# Altium schematic sheet debug.schdoc: DBG
size A4; Date: 10.25.2025; CheckedBy: BCY; DrawnBy: miaow; DocumentNumber: 7; Revision: v1.1.0; SheetNumber: 7; SheetTotal: 14; BoardType: MAIN_PCB; Desc: Debug board interface
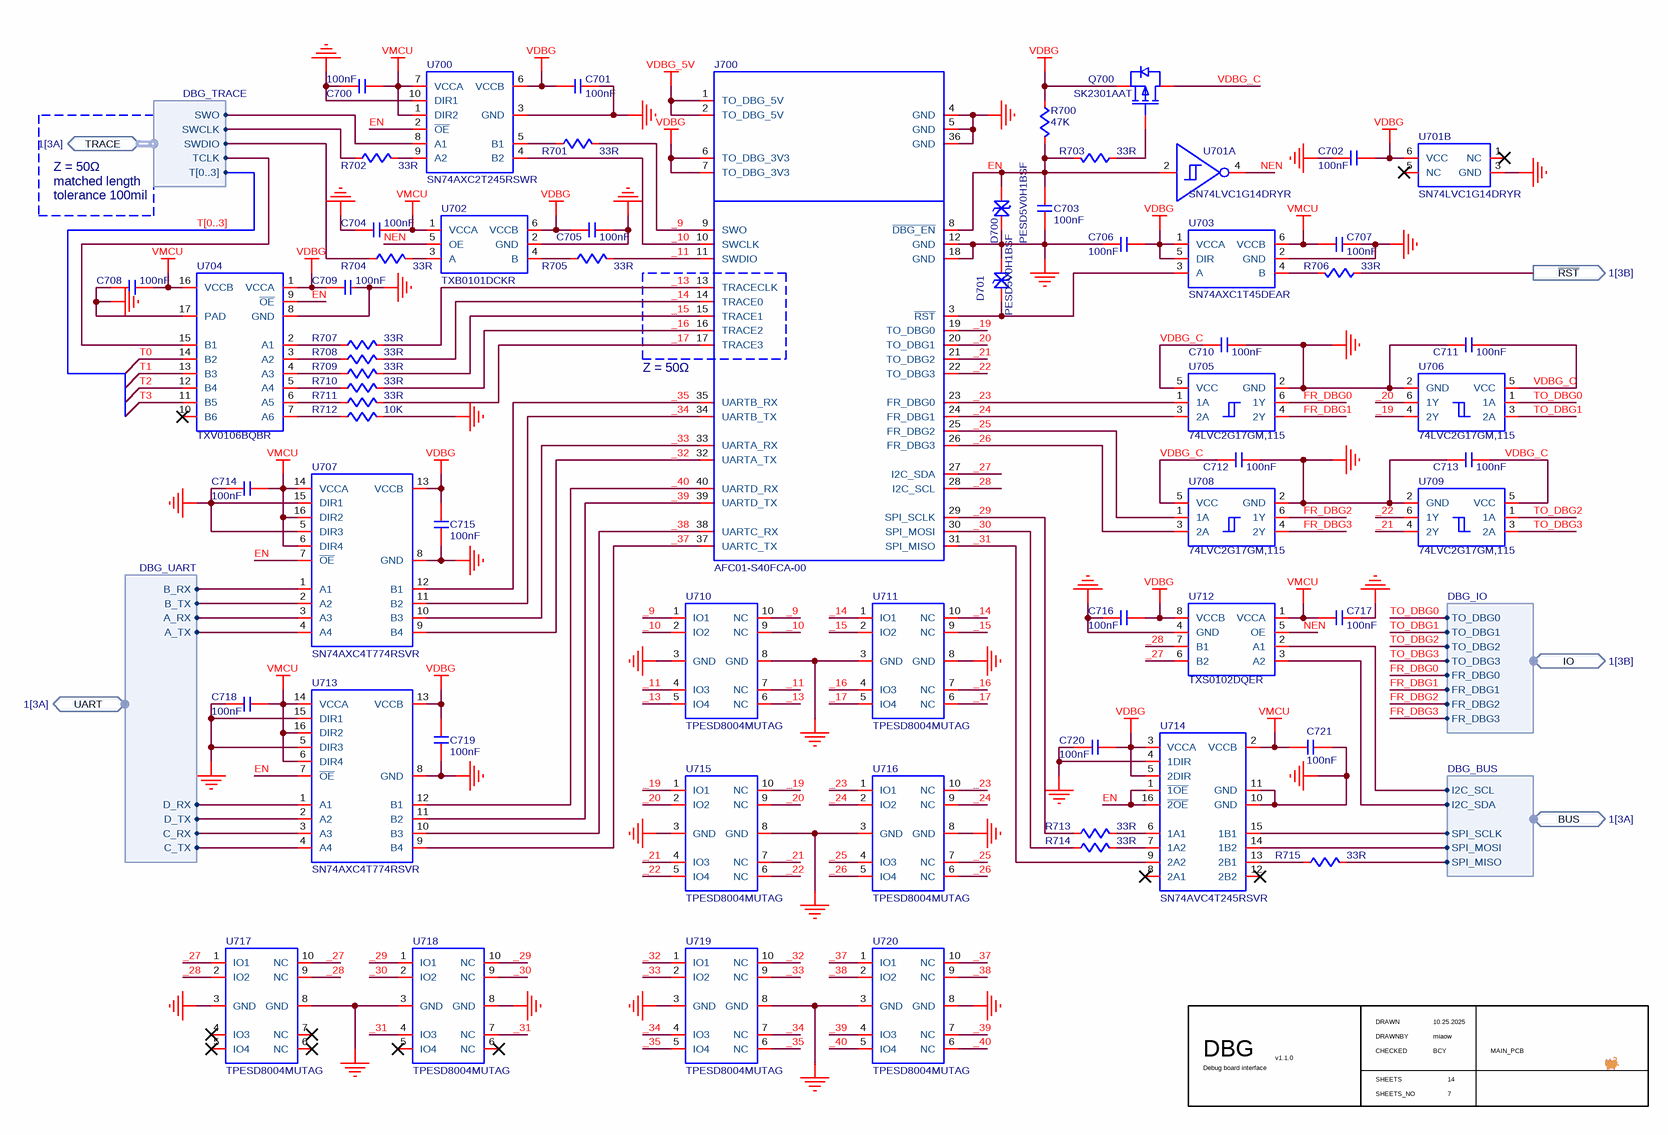
[diagram p0: debug.schdoc]

## Parts
C700  value 100nF  [C0402]  (hidden comment: C-NOMO)
C701  value 100nF  [C0402]  (hidden comment: C-NOMO)
C702  value 100nF  [C0402]  (hidden comment: C-NOMO)
C703  value 100nF  [C0402]  (hidden comment: C-NOMO)
C704  value 100nF  [C0402]  (hidden comment: C-NOMO)
C705  value 100nF  [C0402]  (hidden comment: C-NOMO)
C706  value 100nF  [C0402]  (hidden comment: C-NOMO)
C707  value 100nF  [C0402]  (hidden comment: C-NOMO)
C708  value 100nF  [C0402]  (hidden comment: C-NOMO)
C709  value 100nF  [C0402]  (hidden comment: C-NOMO)
C710  value 100nF  [C0402]  (hidden comment: C-NOMO)
C711  value 100nF  [C0402]  (hidden comment: C-NOMO)
C712  value 100nF  [C0402]  (hidden comment: C-NOMO)
C713  value 100nF  [C0402]  (hidden comment: C-NOMO)
C714  value 100nF  [C0402]  (hidden comment: C-NOMO)
C715  value 100nF  [C0402]  (hidden comment: C-NOMO)
C716  value 100nF  [C0402]  (hidden comment: C-NOMO)
C717  value 100nF  [C0402]  (hidden comment: C-NOMO)
C718  value 100nF  [C0402]  (hidden comment: C-NOMO)
C719  value 100nF  [C0402]  (hidden comment: C-NOMO)
C720  value 100nF  [C0402]  (hidden comment: C-NOMO)
C721  value 100nF  [C0402]  (hidden comment: C-NOMO)
D700  PESD5V0H1BSF  [PESD5V0H1BSF]
D701  PESD5V0H1BSF  [PESD5V0H1BSF]
J700  AFC01-S40FCA-00  [AFC01-S40FCA-00]
Q700  SK2301AAT  [SK2301AAT]
R700  value 47K  [R0402]  (hidden comment: R)
R701  value 33R  [R0402]  (hidden comment: R)
R702  value 33R  [R0402]  (hidden comment: R)
R703  value 33R  [R0402]  (hidden comment: R)
R704  value 33R  [R0402]  (hidden comment: R)
R705  value 33R  [R0402]  (hidden comment: R)
R706  value 33R  [R0402]  (hidden comment: R)
R707  value 33R  [R0402]  (hidden comment: R)
R708  value 33R  [R0402]  (hidden comment: R)
R709  value 33R  [R0402]  (hidden comment: R)
R710  value 33R  [R0402]  (hidden comment: R)
R711  value 33R  [R0402]  (hidden comment: R)
R712  value 10K  [R0402]  (hidden comment: R)
R713  value 33R  [R0402]  (hidden comment: R)
R714  value 33R  [R0402]  (hidden comment: R)
R715  value 33R  [R0402]  (hidden comment: R)
U700  SN74AXC2T245RSWR  [SN74AXC2T245RSWR]
U701  SN74LVC1G14DRYR  [SN74LVC1G14DRYR]  (parts A,B of 2)
U702  TXB0101DCKR  [TXB0101DCKR]
U703  SN74AXC1T45DEAR  [SN74AXC1T45DEAR]
U704  TXV0106BQBR  [TXV0106BQBR]
U705  74LVC2G17GM,115  [74LVC2G17GM,115]
U706  74LVC2G17GM,115  [74LVC2G17GM,115]
U707  SN74AXC4T774RSVR  [SN74AXC4T774RSVR]
U708  74LVC2G17GM,115  [74LVC2G17GM,115]
U709  74LVC2G17GM,115  [74LVC2G17GM,115]
U710  TPESD8004MUTAG  [TPESD8004MUTAG]
U711  TPESD8004MUTAG  [TPESD8004MUTAG]
U712  TXS0102DQER  [TXS0102DQER]
U713  SN74AXC4T774RSVR  [SN74AXC4T774RSVR]
U714  SN74AVC4T245RSVR  [SN74AVC4T245RSVR]
U715  TPESD8004MUTAG  [TPESD8004MUTAG]
U716  TPESD8004MUTAG  [TPESD8004MUTAG]
U717  TPESD8004MUTAG  [TPESD8004MUTAG]
U718  TPESD8004MUTAG  [TPESD8004MUTAG]
U719  TPESD8004MUTAG  [TPESD8004MUTAG]
U720  TPESD8004MUTAG  [TPESD8004MUTAG]

## Ports
BUS (bidir, harness DBG_BUS, see 1[3A]), IO (bidir, harness DBG_IO, see 1[3B]), TRACE (bidir, harness DBG_TRACE, see 1[3A]), UART (bidir, harness DBG_UART, see 1[3A]), ~{RST} (out, see 1[3B])

## Harnesses
DBG_UART: A_TX, A_RX, B_TX, B_RX, C_TX, C_RX, D_TX, D_RX
DBG_TRACE: SWO, SWCLK, SWDIO, TCLK, T[0..3]
DBG_BUS: I2C_SCL, I2C_SDA, SPI_MISO, SPI_MOSI, SPI_SCLK
DBG_IO: TO_DBG0, TO_DBG1, FR_DBG0, TO_DBG3, TO_DBG2, FR_DBG1, FR_DBG2, FR_DBG3

## Nets
GND: C700.2 C701.1 C702.1 C703.2 C704.1 C705.2 C706.1 C707.2 C708.2 C709.2 C710.1 C711.2 C712.1 C713.1 C714.2 C715.1 C716.1 C717.2 C718.2 C719.1 C720.1 C721.2 D700.1 D701.2 J700.4(GND) J700.5(GND) J700.12(GND) J700.18(GND) J700.36(GND) R712.2 U700.3(GND) U700.10(DIR1) U701.3(GND) U702.2(GND) U703.2(GND) U704.8(GND) U704.17(PAD) U705.2(GND) U706.2(GND) U707.5(DIR3) U707.8(GND) U707.15(DIR1) U708.2(GND) U709.2(GND) U710.3(GND) U710.8(GND) U711.3(GND) U711.8(GND) U712.4(GND) U713.5(DIR3) U713.8(GND) U713.15(DIR1) U714.4(1DIR) U714.10(GND) U714.11(GND) U715.3(GND) U715.8(GND) U716.3(GND) U716.8(GND) U717.3(GND) U717.8(GND) U718.3(GND) U718.8(GND) U719.3(GND) U719.8(GND) U720.3(GND) U720.8(GND)
VDBG: C701.2 C702.2 C705.1 C706.2 C709.1 C715.2 C716.2 C719.2 C720.2 J700.6(TO_DBG_3V3) J700.7(TO_DBG_3V3) Q700.S R700.1 U700.6(VCCB) U701.6(VCC) U702.6(VCCB) U703.1(VCCA) U703.5(DIR) U704.1(VCCA) U707.13(VCCB) U712.8(VCCB) U713.13(VCCB) U714.3(VCCA) U714.5(2DIR)
VDBG_5V: J700.1(TO_DBG_5V) J700.2(TO_DBG_5V)
VMCU: C700.1 C704.2 C707.1 C708.1 C714.1 C717.1 C718.1 C721.1 U700.1(DIR2) U700.7(VCCA) U702.1(VCCA) U703.6(VCCB) U704.16(VCCB) U707.6(DIR4) U707.14(VCCA) U707.16(DIR2) U712.1(VCCA) U713.6(DIR4) U713.14(VCCA) U713.16(DIR2) U714.2(VCCB)
_9: J700.9(SWO) R701.2 U710.1(IO1) U710.10(NC)
_10: J700.10(SWCLK) U700.4(B2) U710.2(IO2) U710.9(NC)
_11: J700.11(SWDIO) R705.2 U710.4(IO3) U710.7(NC)
_13: J700.13(TRACECLK) R707.2 U710.5(IO4) U710.6(NC)
_14: J700.14(TRACE0) R708.2 U711.1(IO1) U711.10(NC)
_15: J700.15(TRACE1) R709.2 U711.2(IO2) U711.9(NC)
_16: J700.16(TRACE2) R710.2 U711.4(IO3) U711.7(NC)
_17: J700.17(TRACE3) R711.2 U711.5(IO4) U711.6(NC)
_19: J700.19(TO_DBG0) U706.4(2Y) U715.1(IO1) U715.10(NC)
_20: J700.20(TO_DBG1) U706.6(1Y) U715.2(IO2) U715.9(NC)
_21: J700.21(TO_DBG2) U709.4(2Y) U715.4(IO3) U715.7(NC)
_22: J700.22(TO_DBG3) U709.6(1Y) U715.5(IO4) U715.6(NC)
_23: J700.23(FR_DBG0) U705.1(1A) U716.1(IO1) U716.10(NC)
_24: J700.24(FR_DBG1) U705.3(2A) U716.2(IO2) U716.9(NC)
_25: J700.25(FR_DBG2) U708.1(1A) U716.4(IO3) U716.7(NC)
_26: J700.26(FR_DBG3) U708.3(2A) U716.5(IO4) U716.6(NC)
_27: J700.27(I2C_SDA) U712.6(B2) U717.1(IO1) U717.10(NC)
_28: J700.28(I2C_SCL) U712.7(B1) U717.2(IO2) U717.9(NC)
_29: J700.29(SPI_SCLK) R713.1 U718.1(IO1) U718.10(NC)
_30: J700.30(SPI_MOSI) R714.1 U718.2(IO2) U718.9(NC)
_31: J700.31(SPI_MISO) U714.9(2A2) U718.4(IO3) U718.7(NC)
_32: J700.32(UARTA_TX) U707.9(B4) U719.1(IO1) U719.10(NC)
_33: J700.33(UARTA_RX) U707.10(B3) U719.2(IO2) U719.9(NC)
_34: J700.34(UARTB_TX) U707.11(B2) U719.4(IO3) U719.7(NC)
_35: J700.35(UARTB_RX) U707.12(B1) U719.5(IO4) U719.6(NC)
_37: J700.37(UARTC_TX) U713.9(B4) U720.1(IO1) U720.10(NC)
_38: J700.38(UARTC_RX) U713.10(B3) U720.2(IO2) U720.9(NC)
_39: J700.39(UARTD_TX) U713.11(B2) U720.4(IO3) U720.7(NC)
_40: J700.40(UARTD_RX) U713.12(B1) U720.5(IO4) U720.6(NC)
EN: C703.1 D700.2 J700.8(~{DBG_EN}) R700.2 R703.2 U700.2(~{OE}) U701.2(A) U704.9(~{OE}) U707.7(~{OE}) U713.7(~{OE}) U714.1(~{1OE}) U714.16(~{2OE})
FR_DBG0: U705.6(1Y) ; port IO.FR_DBG0
FR_DBG1: U705.4(2Y) ; port IO.FR_DBG1
FR_DBG2: U708.6(1Y) ; port IO.FR_DBG2
FR_DBG3: U708.4(2Y) ; port IO.FR_DBG3
NEN: U701.4(Y) U702.5(OE) U712.5(OE)
~{RST}: R706.1 ; port ~{RST}
T0: U704.14(B2)
T1: U704.13(B3)
T2: U704.12(B4)
T3: U704.11(B5)
TO_DBG0: U706.1(1A) ; port IO.TO_DBG0
TO_DBG1: U706.3(2A) ; port IO.TO_DBG1
TO_DBG2: U709.1(1A) ; port IO.TO_DBG2
TO_DBG3: U709.3(2A) ; port IO.TO_DBG3
VDBG_C: C710.2 C711.1 C712.2 C713.2 Q700.D U705.5(VCC) U706.5(VCC) U708.5(VCC) U709.5(VCC)
NetD701_1: D701.1 J700.3(~{RST}) U703.3(A)
NetQ700_G: Q700.G R703.1
NetR701_1: R701.1 U700.5(B1)
NetR702_1: R702.1 ; port TRACE.SWCLK
NetR702_2: R702.2 U700.9(A2)
NetR704_1: R704.1 ; port TRACE.SWDIO
NetR704_2: R704.2 U702.3(A)
NetR705_1: R705.1 U702.4(B)
NetR706_2: R706.2 U703.4(B)
NetR707_1: R707.1 U704.2(A1)
NetR708_1: R708.1 U704.3(A2)
NetR709_1: R709.1 U704.4(A3)
NetR710_1: R710.1 U704.5(A4)
NetR711_1: R711.1 U704.6(A5)
NetR712_1: R712.1 U704.7(A6)
NetR713_2: R713.2 U714.6(1A1)
NetR714_2: R714.2 U714.7(1A2)
NetR715_1: R715.1 U714.13(2B1)
NetR715_2: R715.2 ; port BUS.SPI_MISO
NetU700_8: U700.8(A1) ; port TRACE.SWO
NetU704_15: U704.15(B1) ; port TRACE.TCLK
NetU707_1: U707.1(A1) ; port UART.B_RX
NetU707_2: U707.2(A2) ; port UART.B_TX
NetU707_3: U707.3(A3) ; port UART.A_RX
NetU707_4: U707.4(A4) ; port UART.A_TX
NetU712_2: U712.2(A1) ; port BUS.I2C_SCL
NetU712_3: U712.3(A2) ; port BUS.I2C_SDA
NetU713_1: U713.1(A1) ; port UART.D_RX
NetU713_2: U713.2(A2) ; port UART.D_TX
NetU713_3: U713.3(A3) ; port UART.C_RX
NetU713_4: U713.4(A4) ; port UART.C_TX
NetU714_14: U714.14(1B2) ; port BUS.SPI_MOSI
NetU714_15: U714.15(1B1) ; port BUS.SPI_SCLK

Not connected (* = marked no-connect by the designer): U701 1(NC)* 5(NC)*; U704 10(B6)*; U714 8(2A1)* 12(2B2)*; U717 4(IO3)* 5(IO4)* 6(NC)* 7(NC)*; U718 5(IO4)* 6(NC)*

## Buses and harness runs
bus T[0..3]

## Notes on the sheet
- Z = 50Ω
  matched length tolerance 100mil
- (near J700) Z = 50Ω
- DRAWN
- CHECKED
- DRAWNBY
- SHEETS
- SHEETS_NO

## Library data of the parts
C700-C721 = C-NOMO: voltage: 25V; precision: 5%
D700 D701 = PESD5V0H1BSF: TVS/ESD; Supplier 1: LCSC; Supplier Part Number 1: C477989
J700 = FPC-DEBUG: FPC; Supplier 1: LCSC; Supplier Part Number 1: C262674
Q700 = SK2301AAT: PMOS; Supplier 1: LCSC; Supplier Part Number 1: C5334586
R700-R715 = R: precision: 1%
U700 = SN74AXC2T245RSWR: LEVEL SHIFT; Supplier 1: LCSC; Supplier Part Number 1: C1882550
U701 = SN74LVC1G14DRYR: INVERTER - 1bit schmitt; Supplier 1: LCSC; Supplier Part Number 1: C2878125
U702 = TXB0101DCKR: LEVEL SHIFT; Supplier 1: LCSC; Supplier Part Number 1: C324081
U703 = SN74AXC1T45DEAR: LEVEL SHIFT - 1bit, 0.65V - 3.6V, 500Mbps; Supplier 1: LCSC; Supplier Part Number 1: C2677436
U704 = TXV0106BQBR: LEVEL SHIFT; Supplier 1: LCSC; Supplier Part Number 1: C22414342
U705 U706 U708 U709 = 74LVC2G17GM,115: SCHMITT - 2bits; Supplier 1: LCSC; Supplier Part Number 1: C548609
U707 U713 = SN74AXC4T774RSVR: LEVEL SHIFT - 4bits, 0.65V - 3.6V, 310Mbps; Supplier 1: LCSC; Supplier Part Number 1: C779392
U710 U711 U715-U720 = TPESD8004MUTAG: TVS/ESD; Supplier 1: LCSC; Supplier Part Number 1: C2827679
U714 = SN74AVC4T245RSVR: LEVEL SHIFT - 4bits, 2grps, 1.2V - 3.6V, 380Mbps; Supplier 1: LCSC; Supplier Part Number 1: C133244
U712 = TXS0102DQER: Supplier Part Number 1: C2652935; Supplier 1: LCSC; ComponentLink1Description: Datasheet; ComponentLink1URL: ..\ds\txs0102dqer.pdf